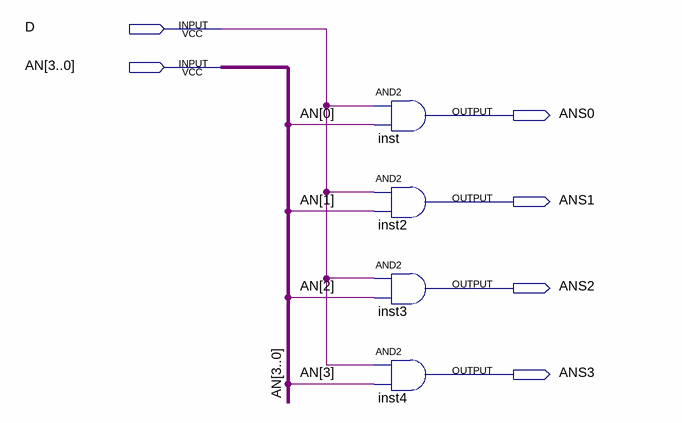
[diagram p0: schematic sheet]
// Quartus schematic AND4_1.bdf as structural Verilog: 4 symbols, 6 pins
module AND4_1 (
  input  D,
  input  [3:0] AN,
  output ANS0,
  output ANS1,
  output ANS2,
  output ANS3
);

  and inst (ANS0, D, AN[0]);
  and inst2 (ANS1, D, AN[1]);
  and inst3 (ANS2, D, AN[2]);
  and inst4 (ANS3, D, AN[3]);
endmodule
